# EAGLE design DB15 (EAGLE 9.6.2)
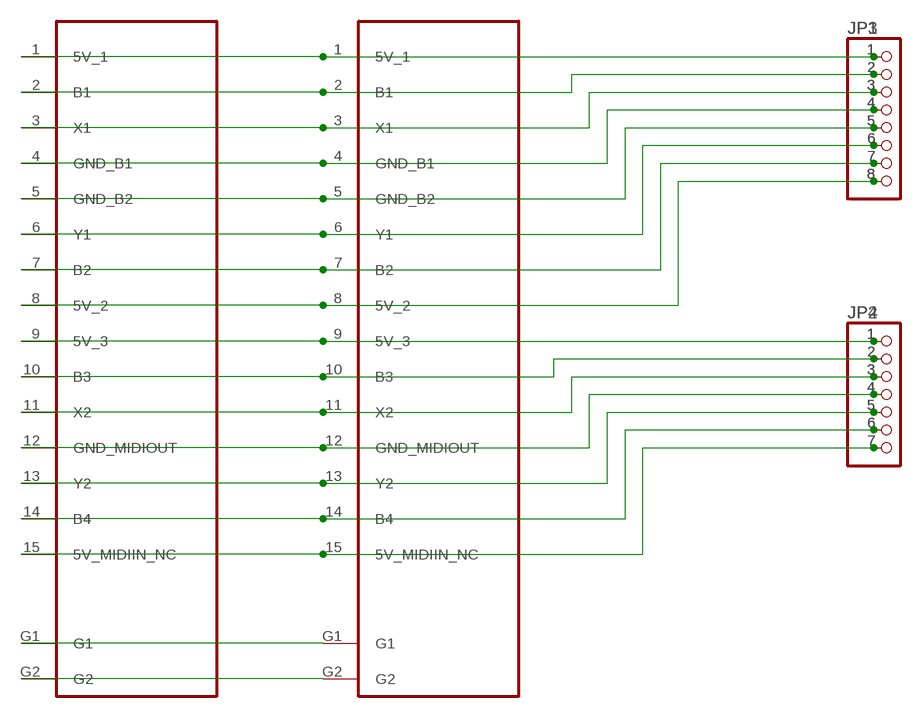
[diagram p0: schematic, sheet 1]

## Parts
JP1  PINHD-1X8  [1X08]
JP2  PINHD-1X7  [1X07]
JP3  PINHD-1X8  [1X08]
JP4  PINHD-1X7  [1X07]
U$1  GAMEPORT_15P  [DA15]
U$2  GAMEPORT_15P  [DA15]

## Nets
N$1: JP1.1 JP3.1 U$1.1(5V_1) U$2.1(5V_1)
N$2: JP1.8 JP3.8 U$1.8(5V_2) U$2.8(5V_2)
N$3: JP2.1 JP4.1 U$1.9(5V_3) U$2.9(5V_3)
N$4: JP2.7 JP4.7 U$1.15(5V_MIDIIN_NC) U$2.15(5V_MIDIIN_NC)
N$5: JP1.2 JP3.2 U$1.2(B1) U$2.2(B1)
N$6: JP1.7 JP3.7 U$1.7(B2) U$2.7(B2)
N$7: JP2.2 JP4.2 U$1.10(B3) U$2.10(B3)
N$8: JP2.6 JP4.6 U$1.14(B4) U$2.14(B4)
N$9: JP1.4 JP3.4 U$1.4(GND_B1) U$2.4(GND_B1)
N$10: JP1.5 JP3.5 U$1.5(GND_B2) U$2.5(GND_B2)
N$11: JP2.4 JP4.4 U$1.12(GND_MIDIOUT) U$2.12(GND_MIDIOUT)
N$12: JP1.3 JP3.3 U$1.3(X1) U$2.3(X1)
N$13: JP2.3 JP4.3 U$1.11(X2) U$2.11(X2)
N$14: JP1.6 JP3.6 U$1.6(Y1) U$2.6(Y1)
N$15: JP2.5 JP4.5 U$1.13(Y2) U$2.13(Y2)
N$16: U$1.G2 U$2.G2
N$17: U$1.G1 U$2.G1

## Library data of the parts
JP1 JP3 = pinhead:PINHD-1X8: PIN HEADER
JP2 JP4 = pinhead:PINHD-1X7: PIN HEADER
U$1 U$2 = DB15:GAMEPORT_15P

## Net classes
1 power: width 0.178 mm

## Board
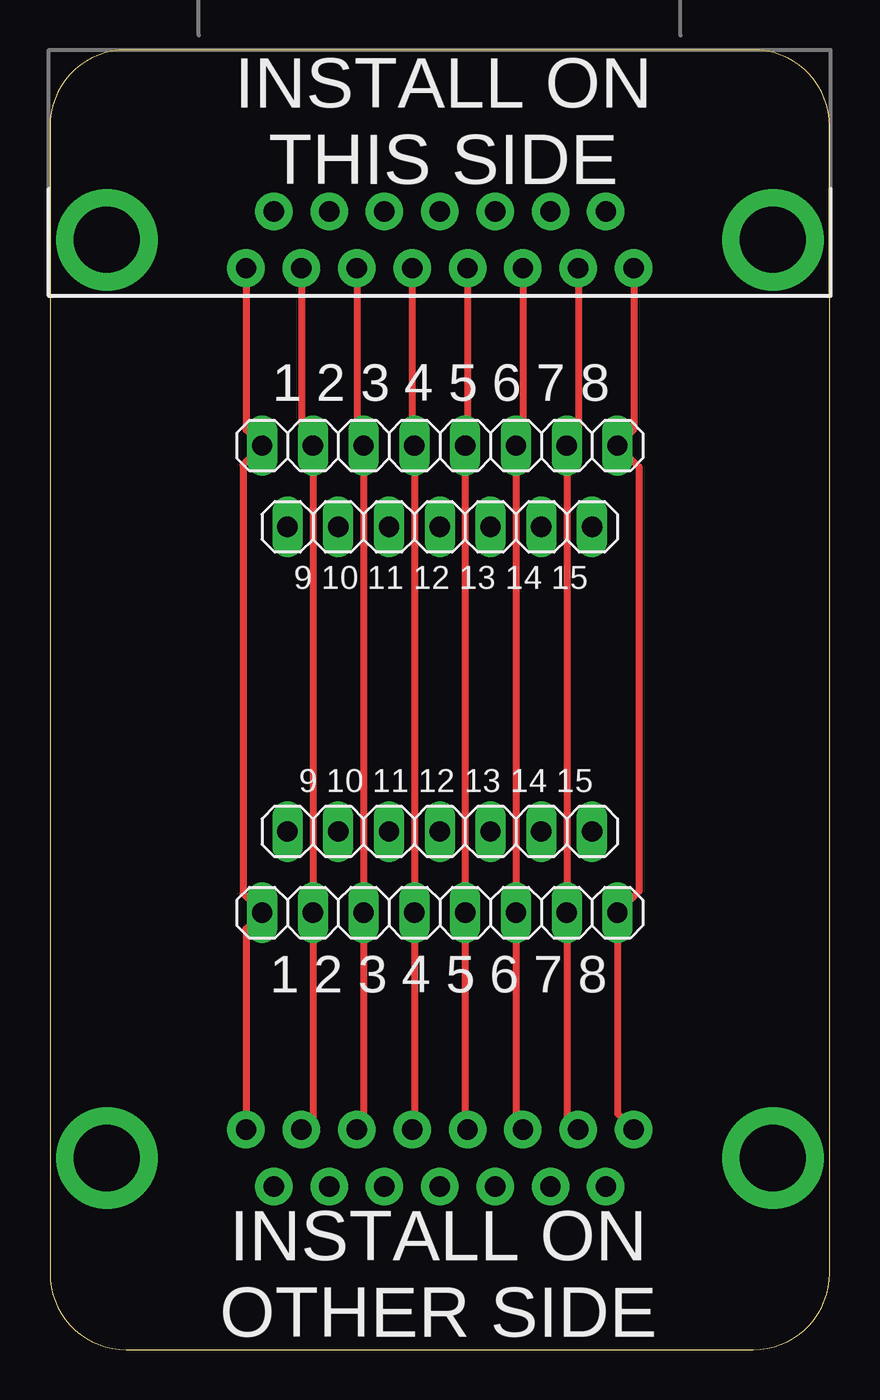
[diagram p1: board, top side]
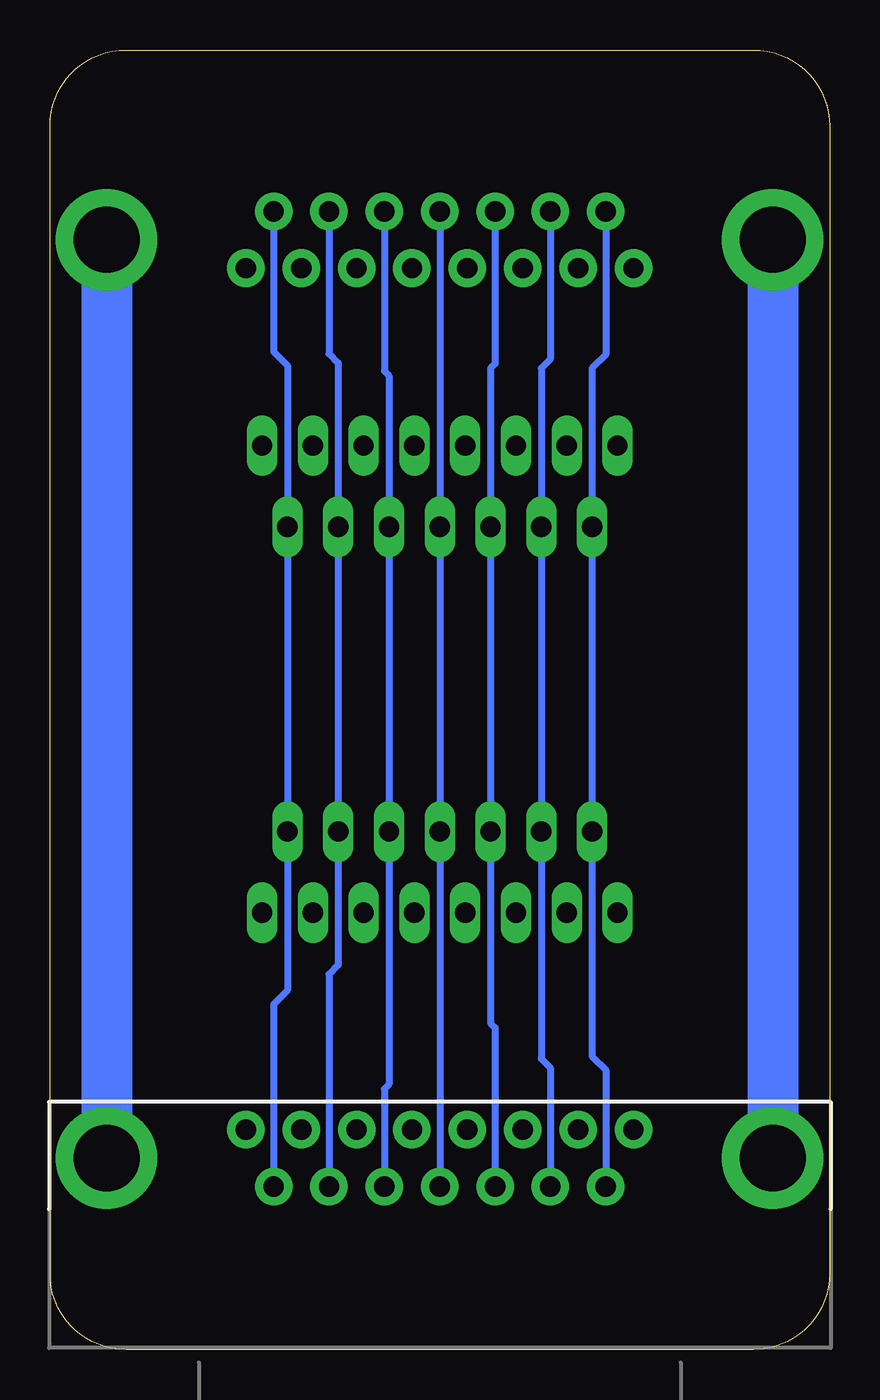
[diagram p2: board, bottom side, seen from below]

Size 39 x 65 mm. Coordinates in mm from the lower left corner, seen from the top.
Outline: 0,61.19 0,3.81 arc90 3.81,0 35.19,0 arc90 39,3.81 39,61.19 arc90 35.19,65 3.81,65 arc90 0,61.19
Copper layers (1*16): Top 0.035mm / dielectric 1.5mm / Bottom 0.035mm
Design rules "deku_2layer_6mil": minimum track width 6mil, minimum drill 15mil, track to track 6mil, track to pad 6mil, pad to pad 6mil, via to via 6mil, smd to smd 6mil, copper to edge 10mil, drill to drill 6mil, minimum pad ring 7mil, minimum via ring 7mil, stop-mask expansion 4mil, vias tented up to drill 25mil, thermal gap 10mil

### Footprints (pad centres in the part's own frame; a part is rotated, then mirrored left to right if it is on the bottom)
1X08 = drill 1.016 long: 1 -8.89,0; 2 -6.35,0; 3 -3.81,0; 4 -1.27,0; 5 1.27,0; 6 3.81,0; 7 6.35,0; 8 8.89,0
1X07 = drill 1.016 long: 1 -7.62,0; 2 -5.08,0; 3 -2.54,0; 4 0,0; 5 2.54,0; 6 5.08,0; 7 7.62,0
DA15 = drill 1.016 pad 1.88: 1 -9.69,-1.42; 2 -6.92,-1.42; 3 -4.15,-1.42; 4 -1.38,-1.42; 5 1.39,-1.42; 6 4.16,-1.42; 7 6.93,-1.42; 8 9.7,-1.42; 9 -8.3,1.42; 10 -5.53,1.42; 11 -2.77,1.42; 12 0,1.42; 13 2.77,1.42; 14 5.54,1.42; 15 8.31,1.42 | drill 3.302 pad 5.08: G1 -16.66,0; G2 16.67,0

### Placement (x,y rotation side)
JP1  19.5,45.21 0 top
JP2  19.5,41.15 0 top
JP3  19.5,21.84 0 top
JP4  19.5,25.91 0 top
U$1  19.5,9.58 180 bottom
U$2  19.5,55.51 0 top

### Tracks (layer width: path | path; a pad name or v marks a point on that pad's centre or on a via)
N$1
  Top 0.356: U$2.1 9.81,46.01 JP1.1 9.65,44.25 9.65,22.8 JP3.1 9.81,21.04 U$1.1
N$2
  Top 0.356: U$2.8 29.2,46.02 JP1.8 29.46,44.14 29.46,22.92 JP3.8 28.39,11.81 U$1.8
N$3
  Bottom 0.356: U$2.9 11.2,49.76 11.88,49.08 JP2.1 JP4.1 11.88,14.67 11.2,13.99 U$1.9
N$4
  Bottom 0.356: U$2.15 27.81,49.91 27.12,49.22 JP2.7 JP4.7 27.12,17.96 27.81,17.27 U$1.15
N$5
  Top 0.356: U$2.2 12.58,45.78 JP1.2 JP3.2 13.15,11.57 U$1.2
N$6
  Top 0.356: U$2.7 26.43,45.79 JP1.7 JP3.7 25.85,11.58 U$1.7
N$7
  Bottom 0.356: U$2.10 13.97,49.53 14.42,49.08 JP2.2 JP4.2 14.42,14.55 13.97,14.1 U$1.10
N$8
  Bottom 0.356: U$2.14 25.04,49.8 24.58,49.34 JP2.6 JP4.6 24.58,19.23 25.04,18.77 U$1.14
N$9
  Top 0.356: U$2.4 18.12,45.32 JP1.4 JP3.4 18.23,11.11 U$1.4
N$10
  Top 0.356: U$2.5 20.89,45.33 JP1.5 JP3.5 20.77,11.12 U$1.5
N$11
  Bottom 0.356: U$2.12 JP2.4 JP4.4 U$1.12
N$12
  Top 0.356: U$2.3 15.35,45.55 JP1.3 JP3.3 15.69,11.34 U$1.3
N$13
  Bottom 0.356: U$2.11 16.73,49.31 16.96,49.08 JP2.3 JP4.3 16.96,16.32 16.73,16.09 U$1.11
N$14
  Top 0.356: U$2.6 23.66,45.56 JP1.6 JP3.6 23.31,11.35 U$1.6
N$15
  Bottom 0.356: U$2.13 22.27,48.94 22.04,48.71 JP2.5 JP4.5 22.04,13.27 22.27,13.04 U$1.13
N$16
  Bottom 2.54: U$2.G2 U$1.G2
N$17
  Bottom 2.54: U$2.G1 U$1.G1

### Text on the board
tPlace: INSTALL ON / THIS SIDE | 1 2 3 4 5 6 7 8 | 9 10 11 12 13 14 15 | 9 10 11 12 13 14 15 | 1 2 3 4 5 6 7 8 | INSTALL ON / OTHER SIDE